# EAGLE schematic Microduino-Core+ (EAGLE 6.3)
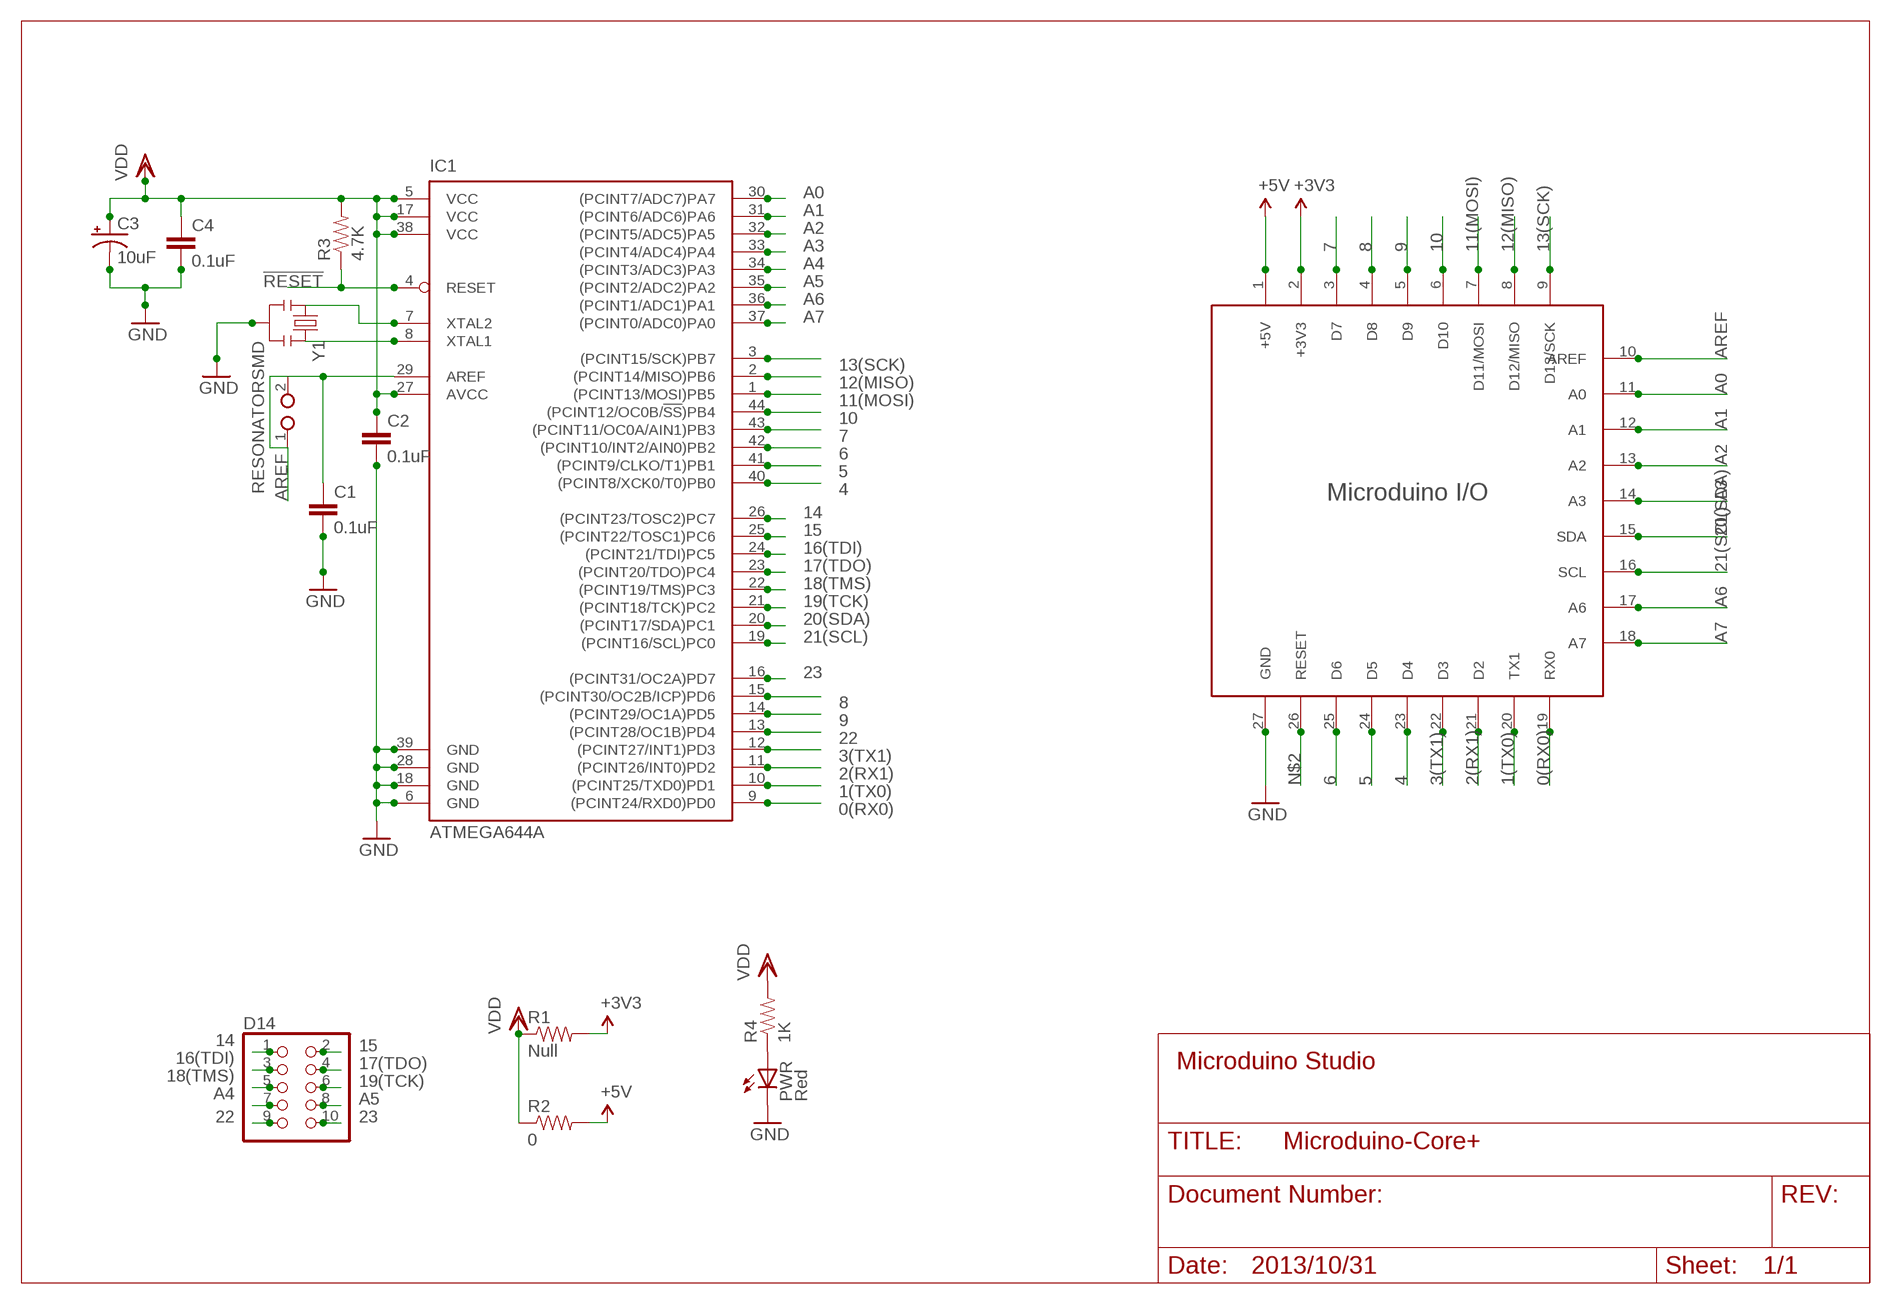
[diagram p0: schematic, sheet 1]

## Parts
C1  0.1uF  CAP0603-CAP  [0603-CAP]
C2  0.1uF  CAP0603-CAP  [0603-CAP]
C3  10uF  CAP_POL3528  [EIA3528]
C4  0.1uF  CAP0603-CAP  [0603-CAP]
D14  PINHD-2X5  [2X05]
IC1  ATMEGA644A  [TQFP44]
PWR  Red  LED0805  [0805-LED]
R1  Null  RESISTOR0603-RES  [0603-RES]
R2  0  RESISTOR0603-RES  [0603-RES]
R3  4.7K  RESISTOR0603-RES  [0603-RES]
R4  1K  RESISTOR0603-RES  [0603-RES]
U$1  MICRDUINO-PIN/NORMAL+  [27UPIN-NORMAL+]
U$4  JUMPER1-1  [JUMPER1-1]
Y1  RESONATORSMD  [RESONATOR-SMD]

## Nets
0(RX0): IC1.9((PCINT24/RXD0)PD0) U$1.19(RX0)
1(TX0): IC1.10((PCINT25/TXD0)PD1) U$1.20(TX1)
2(RX1): IC1.11((PCINT26/INT0)PD2) U$1.21(D2)
3(TX1): IC1.12((PCINT27/INT1)PD3) U$1.22(D3)
4: IC1.40((PCINT8/XCK0/T0)PB0) U$1.23(D4)
5: IC1.41((PCINT9/CLKO/T1)PB1) U$1.24(D5)
6: IC1.42((PCINT10/INT2/AIN0)PB2) U$1.25(D6)
7: IC1.43((PCINT11/OC0A/AIN1)PB3) U$1.3(D7)
8: IC1.15((PCINT30/OC2B/ICP)PD6) U$1.4(D8)
9: IC1.14((PCINT29/OC1A)PD5) U$1.5(D9)
10: IC1.44((PCINT12/OC0B/!SS!)PB4) U$1.6(D10)
11(MOSI): IC1.1((PCINT13/MOSI)PB5) U$1.7(D11/MOSI)
12(MISO): IC1.2((PCINT14/MISO)PB6) U$1.8(D12/MISO)
13(SCK): IC1.3((PCINT15/SCK)PB7) U$1.9(D13/SCK)
14: D14.1 IC1.26((PCINT23/TOSC2)PC7)
15: D14.2 IC1.25((PCINT22/TOSC1)PC6)
16(TDI): D14.3 IC1.24((PCINT21/TDI)PC5)
17(TDO): D14.4 IC1.23((PCINT20/TDO)PC4)
18(TMS): D14.5 IC1.22((PCINT19/TMS)PC3)
19(TCK): D14.6 IC1.21((PCINT18/TCK)PC2)
20(SDA): IC1.20((PCINT17/SDA)PC1) U$1.15(SDA)
21(SCL): IC1.19((PCINT16/SCL)PC0) U$1.16(SCL)
22: D14.9 IC1.13((PCINT28/OC1B)PD4)
23: D14.10 IC1.16((PCINT31/OC2A)PD7)
!RESET: IC1.4(RESET) R3.1
+3V3: R1.2 U$1.2(+3V3)
+5V: R2.2 U$1.1(+5V)
A0: IC1.30((PCINT7/ADC7)PA7) U$1.11(A0)
A1: IC1.31((PCINT6/ADC6)PA6) U$1.12(A1)
A2: IC1.32((PCINT5/ADC5)PA5) U$1.13(A2)
A3: IC1.33((PCINT4/ADC4)PA4) U$1.14(A3)
A4: D14.7 IC1.34((PCINT3/ADC3)PA3)
A5: D14.8 IC1.35((PCINT2/ADC2)PA2)
A6: IC1.36((PCINT1/ADC1)PA1) U$1.17(A6)
A7: IC1.37((PCINT0/ADC0)PA0) U$1.18(A7)
AREF: C1.1 IC1.29(AREF) U$1.10(AREF) U$4.1 U$4.2
GND: C1.2 C2.2 C3.C(-) C4.2 IC1.6(GND) IC1.18(GND) IC1.28(GND) IC1.39(GND) PWR.C U$1.27(GND) Y1.2
N$1: PWR.A R4.1
N$2: U$1.26(RESET)
N$3: IC1.7(XTAL2) Y1.1
N$4: IC1.8(XTAL1) Y1.3
VDD: C2.1 C3.A(+) C4.1 IC1.5(VCC) IC1.17(VCC) IC1.27(AVCC) IC1.38(VCC) R1.1 R2.1 R3.2 R4.2

## Notes on the sheet
- Microduino Studio
- 2013/10/31

## Library data of the parts
C1 C2 C4 = microduino:CAP: Capacitor Standard 0603 ceramic capacitor, and 0.1" leaded capacitor.
C3 = microduino:CAP_POL: Capacitor Polarized These are standard SMD and PTH capacitors. Normally 10uF, 47uF, and 100uF in electrolytic and tantalum varieties. Always verify the external diameter of the through hole cap, it varies with capacity, voltage, and manufacturer. The EIA devices should be standard.
D14 = microduino:PINHD-2X5: PIN HEADER
IC1 = microduino:ATMEGA644: 8-bit Microcontroller with 64K Bytes In-System Programmable Flash Source: http://www.atmel.com/dyn/resources/prod_documents/doc2593.pdf; MPN: ATMEGA644PV-10AU; OC_FARNELL: 1455123; OC_NEWARK: 58M3748
PWR = microduino:LED: LEDs Standard schematic elements and footprints for 5mm, 3mm, 1206, and 0603 sized LEDs. 5mm - Spark Fun Electronics SKU : COM-00529 (and others)
R1-R4 = microduino:RESISTOR: Resistor Basic schematic elements and footprints for 0603, 1206, and PTH 1/10th watt (small) resistors.
U$1 = microduino:MICRDUINO-PIN: microduino引脚封装
U$4 = microduino:JUMPER1-1
Y1 = microduino:RESONATOR: Resonator Small SMD resonator. This is the itty bitty 10/20MHz resonators with built in caps. CSTCE10M0G55 and CSTCE20M0V53. Footprint has been reviewed closely but hasn't been tested yet.

## Net classes
1 power: width 0.381 mm
3 antenna: width 0.61 mm